# EAGLE design disinfection device control system (EAGLE 7.2.0)
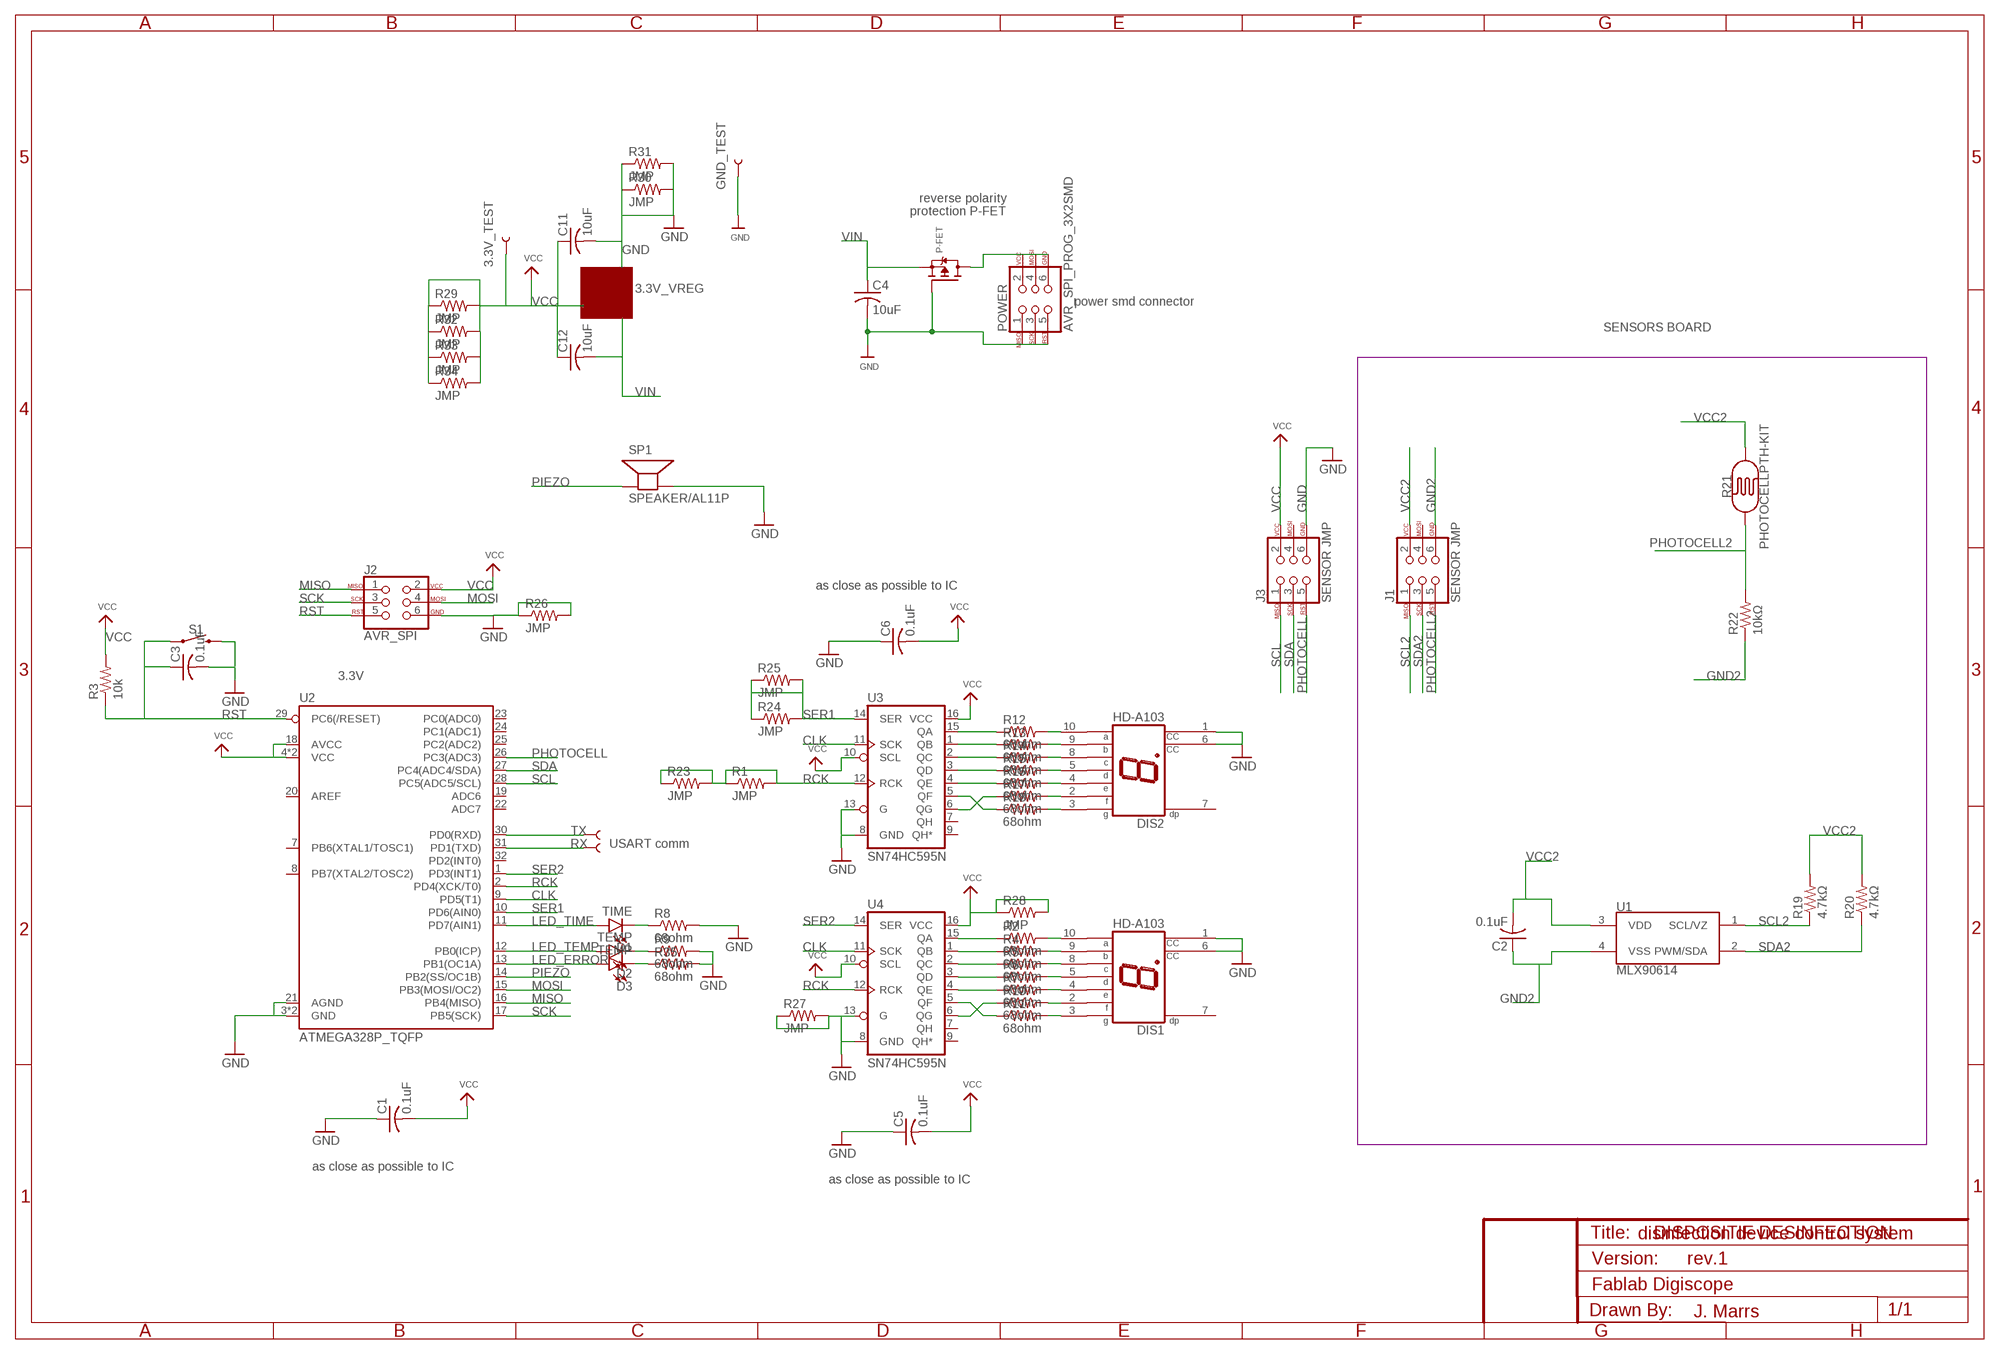
[diagram p0: schematic, sheet 1]

## Parts
3.3V_TEST  TEST-POINT3  [PAD.03X.03]
3.3V_VREG  MOSFET_PCH-DMG2305UX-7  [SOT23-3]
C1  0.1uF  C-USC1206  [C1206]
C2  0.1uF  C-USC1206  [C1206]
C3  0.1uF  C-USC1206  [C1206]
C4  10uF  C-USC1206  [C1206]
C5  0.1uF  C-USC1206  [C1206]
C6  0.1uF  C-USC1206  [C1206]
C11  10uF  C-USC1206  [C1206]
C12  10uF  C-USC1206  [C1206]
D1  TIME  LED-RED1206  [LED-1206]
D2  TEMP  LED-RED1206  [LED-1206]
D3  TEMP  LED-RED1206  [LED-1206]
DIS1  HD-A103  [HDSP-A]
DIS2  HD-A103  [HDSP-A]
GND_TEST  TEST-POINT3  [PAD.03X.03]
J1  SENSOR JMP  AVR_SPI_PROG_3X2SMD  [2X3_SMT_POSTS]
J2  AVR_SPI  AVR_SPI_PROG_3X2SMD  [2X3_SMT_POSTS]
J3  SENSOR JMP  AVR_SPI_PROG_3X2SMD  [2X3_SMT_POSTS]
P-FET  MOSFET-PWIDE  [SOT23-WIDE]
POWER  AVR_SPI_PROG_3X2SMD  [2X3_SMT_POSTS]
R1  JMP  R-US_R1206  [R1206]
R2  68ohm  R-US_R1206  [R1206]
R3  10k  R-US_R1206  [R1206]
R4  68ohm  R-US_R1206  [R1206]
R5  68ohm  R-US_R1206  [R1206]
R6  68ohm  R-US_R1206  [R1206]
R7  68ohm  R-US_R1206  [R1206]
R8  68ohm  R-US_R1206  [R1206]
R9  68ohm  R-US_R1206  [R1206]
R10  68ohm  R-US_R1206  [R1206]
R11  68ohm  R-US_R1206  [R1206]
R12  68ohm  R-US_R1206  [R1206]
R13  68ohm  R-US_R1206  [R1206]
R14  68ohm  R-US_R1206  [R1206]
R15  68ohm  R-US_R1206  [R1206]
R16  68ohm  R-US_R1206  [R1206]
R17  68ohm  R-US_R1206  [R1206]
R18  68ohm  R-US_R1206  [R1206]
R19  4.7kΩ  R-US_R1206  [R1206]
R20  4.7kΩ  R-US_R1206  [R1206]
R21  PHOTOCELLPTH-KIT  [PHOTOCELL-KIT]
R22  10kΩ  R-US_R1206  [R1206]
R23  JMP  R-US_R1206  [R1206]
R24  JMP  R-US_R1206  [R1206]
R25  JMP  R-US_R1206  [R1206]
R26  JMP  R-US_R1206  [R1206]
R27  JMP  R-US_R1206  [R1206]
R28  JMP  R-US_R1206  [R1206]
R29  JMP  R-US_R1206  [R1206]
R30  JMP  R-US_R1206  [R1206]
R31  JMP  R-US_R1206  [R1206]
R32  JMP  R-US_R1206  [R1206]
R33  JMP  R-US_R1206  [R1206]
R34  JMP  R-US_R1206  [R1206]
R35  68ohm  R-US_R1206  [R1206]
RX  TEST-POINT3  [PAD.03X.03]
S1  MOMENTARY-SWITCH-SPST-PTH-6.0MM  [TACTILE_SWITCH_PTH_6.0MM]
SP1  SPEAKER/AL11P  [AL11P]
TX  TEST-POINT3  [PAD.03X.03]
U1  MLX90614  [TO-39]
U2  ATMEGA328P_TQFP  [TQFP32-08]
U3  SN74HC595N  74HC595N  [DIP16]
U4  SN74HC595N  74HC595N  [DIP16]

## Nets
CLK: U2.9(PD5(T1)) U3.11(SCK) U4.11(SCK)
GND: 3.3V_VREG.3(D) C1.1 C3.2 C4.2 C5.1 C6.1 C11.2 DIS1.1(CC) DIS1.6(CC) DIS2.1(CC) DIS2.6(CC) GND_TEST.P$1 J2.6 J3.6 P-FET.1(G) POWER.1 POWER.3 POWER.5 R8.2 R9.2 R26.1 R26.2 R27.1 R27.2 R30.1 R30.2 R31.1 R31.2 R35.2 S1.3 SP1.- U2.3(GND) U2.5(GND) U2.21(AGND) U3.8(GND) U3.13(G) U4.8(GND) U4.13(G)
GND2: C2.1 J1.6 R22.1 U1.4(VSS)
LED_ERROR: D3.A U2.13(PB1(OC1A))
LED_TEMP: D2.A U2.12(PB0(ICP))
LED_TIME: D1.A U2.11(PD7(AIN1))
MISO: J2.1 U2.16(PB4(MISO))
MOSI: J2.4 U2.15(PB3(MOSI/OC2))
N$1: DIS1.10(A) R2.2
N$2: DIS1.9(B) R4.2
N$4: DIS1.8(C) R5.2
N$5: DIS1.5(D) R6.2
N$6: TX.P$1 U2.30(PD0(RXD))
N$7: RX.P$1 U2.31(PD1(TXD))
N$8: DIS1.4(E) R7.2
N$9: R2.1 U4.15(QA)
N$10: R4.1 U4.1(QB)
N$11: D2.C R9.1
N$12: DIS1.2(F) R10.2
N$13: DIS1.3(G) R11.2
N$14: R5.1 U4.2(QC)
N$15: R6.1 U4.3(QD)
N$16: R7.1 U4.4(QE)
N$17: R10.1 U4.6(QG)
N$18: R11.1 U4.5(QF)
N$19: R17.1 U3.6(QG)
N$20: R18.1 U3.5(QF)
N$21: DIS2.10(A) R12.2
N$22: DIS2.9(B) R13.2
N$23: DIS2.8(C) R14.2
N$24: DIS2.5(D) R15.2
N$25: DIS2.4(E) R16.2
N$26: DIS2.2(F) R17.2
N$27: DIS2.3(G) R18.2
N$28: R12.1 U3.15(QA)
N$29: R13.1 U3.1(QB)
N$30: R14.1 U3.2(QC)
N$31: R15.1 U3.3(QD)
N$32: R16.1 U3.4(QE)
N$36: D3.C R35.1
PHOTOCELL: J3.5 U2.26(PC3(ADC3))
PHOTOCELL2: J1.5 R21.1 R22.2
PIEZO: SP1.+ U2.14(PB2(SS/OC1B))
PWRIN: P-FET.3(D) POWER.2 POWER.4 POWER.6
RCK: R1.1 R1.2 R23.1 R23.2 U2.2(PD4(XCK/T0)) U3.12(RCK) U4.12(RCK)
RST: C3.1 J2.5 R3.1 S1.1 U2.29(PC6(/RESET))
SCK: J2.3 U2.17(PB5(SCK))
SCL: J3.1 U2.28(PC5(ADC5/SCL))
SCL2: J1.1 R19.1 U1.1(SCL/VZ)
SDA: J3.3 U2.27(PC4(ADC4/SDA))
SDA2: J1.3 R20.1 U1.2(PWM/SDA)
SER1: R24.1 R24.2 R25.1 R25.2 U2.10(PD6(AIN0)) U3.14(SER)
SER2: U2.1(PD3(INT1)) U4.14(SER)
TIME: D1.C R8.1
VCC: 3.3V_TEST.P$1 3.3V_VREG.1(G) C1.2 C5.2 C6.2 C11.1 C12.1 J2.2 J3.2 R3.2 R28.1 R28.2 R29.1 R29.2 R32.1 R32.2 R33.1 R33.2 R34.1 R34.2 U2.4(VCC) U2.6(VCC) U2.18(AVCC) U3.10(SCL) U3.16(VCC) U4.10(SCL) U4.16(VCC)
VCC2: C2.2 J1.2 R19.2 R20.2 R21.2 U1.3(VDD)
VIN: 3.3V_VREG.2(S) C4.1 C12.2 P-FET.2(S)
Unconnected: DIS1.7(DP) DIS2.7(DP) J1.4 J3.4 U2.7(PB6(XTAL1/TOSC1)) U2.8(PB7(XTAL2/TOSC2)) U2.19(ADC6) U2.20(AREF) U2.22(ADC7) U2.23(PC0(ADC0)) U2.24(PC1(ADC1)) U2.25(PC2(ADC2)) U2.32(PD2(INT0)) U3.7(QH) U3.9(QH*) U4.7(QH) U4.9(QH*)

## Notes on the sheet
- reverse polarity
- protection P-FET
- power smd connector
- SENSORS BOARD
- as close as possible to IC
- 3.3V
- USART comm
- as close as possible to IC
- as close as possible to IC
- DISPOSITIF DESINFECTION
- rev.1
- Fablab Digiscope
- J. Marrs

## Library data of the parts
3.3V_TEST GND_TEST RX TX = SparkFun-Connectors:TEST-POINT: SparkFun Test Points Bare copper test points for troubleshooting or In-Circuit-Testing. These are used by our Production team for verifying production board runs using pogo-pins on test beds. SparkFun Products: SparkFun LSM9DS1 Breakout <https://www.sparkfun.com/products/13284> SparkFun PSOC <https://www.sparkfun.com/products/13714> SparkFun Load Cell Amplifier <https://www.sparkfun.com/products/13879>
3.3V_VREG = SparkFun-DiscreteSemi:MOSFET_PCH: P-channel MOSFETs Voltage controlled devices that allow control of high current outputs. SparkFun Products: SparkFun ESP32 Thing <https://www.sparkfun.com/products/13907> SparkFun ESP8266 Thing <https://www.sparkfun.com/products/13231> SparkFun Pi Servo HAT V2 <https://www.sparkfun.com/products/15316> DMG2305UX-7 (20V/4.2A/SOT23-3); PROD_ID: TRAN-14388; VALUE: 20V/4.2A/52mΩ/1.4W
C1-C6 C11 C12 = adafruit:C-US: CAPACITOR, American symbol
D1-D3 = SparkFun-LED:LED-RED: Red SMD LED Used in manufacturing of most products at SparkFun Packages: 0603 - SMD 0603 package [Product Link] <http://docs.avagotech.com/docs/AV02-0551EN> 0603 SMART - SMD 0603 SMART package ( more efficient and expensive)[Product Link] <http://www.osram-os.com/Graphics/XPic2/00077099_0.pdf> 1206 - SMD1206 package [Product Link] <https://www.sparkfun.com/datasheets/DevTools/LilyPad/Q150OVS4.pdff> SparkFun Products: Pro Mini 328 -5V <https://www.sparkfun.com/products/821> RedBoard <https://www.sparkfun.com/products/12757> IOIO-OTG <https://www.sparkfun.com/products/13613>; PROD_ID: DIO-09912; VALUE: RED
DIS1 DIS2 = display-hp:HD-A103: LED DISPLAY 1-character 7 segment, decimal point right; OC_FARNELL: unknown; OC_NEWARK: unknown
J1-J3 POWER = SparkFun-Connectors:AVR_SPI_PROG_3X2: AVR ISP 6 Pin This is the reduced ISP connector for AVR programming. Common on Arduino. This footprint will take up less PCB space and can be used with a 10-pin to 6-pin adapter such as SKU: BOB-08508 **Special note about "TEST_POINT" package. The stop mask is on the top side, so if you want your programming test points to be on the bottom of your board, make sure to place this package on the bottom side of the board. This also ensure that the orientation to program from the bottom side will be correct. SparkFun Products: SparkFun ISP Pogo Adapter <https://www.sparkfun.com/products/11591> - NS Tiny AVR Programmer <https://www.sparkfun.com/products/11801> -PTH
P-FET = microbuilder:MOSFET-P: P-Channel Mosfet LEGEND VDS: Voltage Drain-Source ID: Drain Current RDS(ON): Drain-Source On-State Resistance VGS(TH): Gate-Source Threshold Voltage CISS: Drain-Source Input Capacitance SOT-23 Name VDS ID RDS(ON) VGS(TH) CISS Order Number IRLML5103 30V 760mA 600 mOhm -- 75pF @ 25V Digikey: IRLML5103PBFCT-ND IRLML6401 12V 4.3A 50 mOhm 950mV @ 250µA 830pF @ 10V Digikey: IRLML6401PBFTR-ND NTR0202PL 20V 400mA 800 mOhm 2.3V @ 250uA 70pF @ 5V Digikey: NTR0202PLT1GOSTR-ND NTR4101PT1G 20V 1.8A 85 mOhm 1.2V @ 250uA 675pF @ 10V Digikey: NTR4101PT1GOSCT-ND DMP2004K 20V 600mA 900 mOhm 1V @ 250uA 175pF @ 16V Digikey: DMP2004KDICT-ND PMV65XP 20V 3.9A 76 mOhm 950mV @ 1mA 725pF @ 20V Digikey: 568-2358-2-ND TO-252 Name VDS ID RDS(ON) VGS(TH) CISS Order Number AOD417 30V 25A 34 mOhm 3V @ 250µA 920pF @ 15V Digikey: 785-1106-2-ND
R1-R20 R22-R35 = adafruit:R-US_: RESISTOR, American symbol
R21 = SparkFun-Sensors:PHOTOCELL: Photocell (Photodetector, Photo Resistor, CdS) This is a very small light sensor. A photocell changes (also called a photodetector, photo resistor, CdS or photoconductive cell) resistance depending on the amount of light it is exposed to. These little sensors make great ambient light triggers (when light in the room turns on, do something). Datasheet <http://cdn.sparkfun.com/datasheets/Sensors/LightImaging/SEN-09088.pdf> SparkFun Products Mini Photocell <https://www.sparkfun.com/products/9088> (SEN-09088); PROD_ID: COMP-09129; SF_ID: SEN-09088
S1 = SparkFun-Switches:MOMENTARY-SWITCH-SPST: Momentary Switch (Pushbutton) - SPST Normally-open (NO) SPST momentary switches (buttons, pushbuttons). Variants PTH-12MM - 12mm square, through-hole Momentary Pushbutton Switch - 12mm Square <https://www.sparkfun.com/products/9190> (COM-09190) PTH-6.0MM, PTH-6.0MM-KIT - 6.0mm square, through-hole Mini Pushbutton Switch <https://www.sparkfun.com/products/97> (COM-00097) KIT package intended for soldering kit's - only one side of pads' copper is exposed. PTH-RIGHT-ANGLE-KIT - Right-angle, through-hole Right Angle Tactile Button <https://www.sparkfun.com/products/10791> - Used on SparkFun BigTime Watch Kit <https://www.sparkfun.com/products/11734> SMD-12MM - 12mm square, surface-mount Tactile Button - SMD (12mm) <https://www.sparkfun.com/products/12993> (COM-12993) Used on SparkFun PicoBoard <https://www.sparkfun.com/products/11888> SMD-4.5MM - 4.5mm Square Trackball Switch Used on SparkFun Blackberry Trackballer Breakout <https://www.sparkfun.com/products/13169> SMD-4.6MMX2.8MM - 4.60mm x 2.80mm, surface mount Used on SparkFun SAMD21 Mini Breakout <https://www.sparkfun.com/products/13664> SMD-5.2MM, SMD-5.2-REDUNDANT - 5.2mm square, surface-mount Mini Pushbutton Switch - SMD <https://www.sparkfun.com/products/8720> (COM-08720) Used on Arduino Pro Mini <https://www.sparkfun.com/products/11114> REDUNDANT package connects both switch circuits together SMD-6.0X3.5MM - 6.0 x 3.5mm, surface mount Momentary Reset Switch SMD <https://www.sparkfun.com/products/8229> (COM-08229) SMD-6.2MM-TALL - 6.2mm square, surface mount Tactile Button - SMD (6mm) <https://www.sparkfun.com/products/12992> Used on SparkFun Digital Sandbox <https://www.sparkfun.com/products/12651> SMD-RIGHT-ANGLE - Right-angle, surface mount Used on SparkFun Block for Intel® Edison - Arduino <https://www.sparkfun.com/products/13036>; PROD_ID: SWCH-08441; SF_SKU: COM-00097
SP1 = adafruit:SPEAKER: SPEAKER Source: Buerklin Added PS12 (for part # PS1240 piezo) http://www.ladyada.net/library/pcb/eaglelibrary.html
U1 = SparkFun-Sensors:MLX90614: Melexis MLX90614 Infrared (IR) Thermometer The MLX90614 is a passive infrared (PIR) I2C temperature sensor.It is designed for non-contact temperature sensing. An internal 17-bit ADC and a powerful DSP contribute to the MLX90614’s high accuracy and resolution. It has a huge number of applications including body temperature measurment and movement detection. Datasheet <http://www.sparkfun.com/datasheets/Sensors/Temperature/SEN-09570-datasheet-3901090614M005.pdf> SparkFun Products Infrared Thermometer - MLX90614 <https://www.sparkfun.com/products/9570> (SEN-09570) SparkFun IR Thermometer Evaluation Board - MLX90614 <https://www.sparkfun.com/products/10740> (SEN-10740); PROD_ID: COMP-09719; SF_ID: SEN-09570
U2 = SparkFun-IC-Microcontroller:ATMEGA328P_TQFP: Popular 328P in QFP Storefront component: ATmega328 - TQFP <https://www.sparkfun.com/products/13448> (COM-13448) Datasheet <http://www.sparkfun.com/datasheets/Components/SMD/ATMega328.pdf> SparkFun Products SparkFun RedBoard - Programmed with Arduino <https://www.sparkfun.com/products/12757> (DEV-12757) Arduino Pro Mini 328 - 5V/16MHz <https://www.sparkfun.com/products/11113> (DEV-11113) Arduino Pro Mini 328 - 3.3V/8MHz <https://www.sparkfun.com/products/11114> (DEV-11114) SparkFun OpenLog <https://www.sparkfun.com/products/13712> (DEV-13712) SparkFun MicroView - OLED Arduino Module <https://www.sparkfun.com/products/12923> (DEV-12923) SparkFun Digital Sandbox <https://www.sparkfun.com/products/12651> (DEV-12651) SparkFun PicoBoard <https://www.sparkfun.com/products/11888> (WIG-11888) Arduino Fio <https://www.sparkfun.com/products/10116> (DEV-10116) LilyPad Arduino 328 Main Board <https://www.sparkfun.com/products/13342> (DEV-13342) SparkFun RedStick <https://www.sparkfun.com/products/13741> (DEV-13741) LilyPad MP3 <https://www.sparkfun.com/products/11013> (DEV-11013) LilyPad Arduino SimpleSnap <https://www.sparkfun.com/products/10941> (DEV-10941) SparkFun Stepoko <https://www.sparkfun.com/products/13899> (ROB-13899) SparkFun Geiger Counter <https://www.sparkfun.com/products/11345> (SEN-11345) SparkFun EL Sequencer <https://www.sparkfun.com/products/12781> (COM-12781) Arduino Pro 328 - 5V/16MHz <https://www.sparkfun.com/products/10915> (DEV-10915) CryptoCape <https://www.sparkfun.com/products/12773> (DEV-12773) SparkFun IR Thermometer Evaluation Board - MLX90614 <https://www.sparkfun.com/products/10740> (SEN-10740) SparkFun RedBot Mainboard <https://www.sparkfun.com/products/12097> (ROB-12097) Arduino Pro 328 - 3.3V/8MHz <https://www.sparkfun.com/products/10914> (DEV-10914) SparkFun Block for Intel® Edison - Arduino <https://www.sparkfun.com/products/13036> (DEV-13036) SparkFun Simon Says - Surface Mount Soldering Kit <https://www.sparkfun.com/products/10935> (KIT-10935) SparkFun 7-Segment Serial Display - Red <https://www.sparkfun.com/products/11441> (COM-11441) SparkFun 7-Segment Serial Display - White <https://www.sparkfun.com/products/11629> (COM-11629) SparkFun 7-Segment Serial Display - Yellow <https://www.sparkfun.com/products/11443> (COM-11443) SparkFun 7-Segment Serial Display - Kelly Green <https://www.sparkfun.com/products/11440> (COM-11440) SparkFun 7-Segment Serial Display - Blue <https://www.sparkfun.com/products/11442> (COM-11442) SparkFun OpenSegment Serial Display - 20mm (Blue) <https://www.sparkfun.com/products/11647> (COM-11647) SparkFun OpenSegment Serial Display - 20mm (Green) <https://www.sparkfun.com/products/11646> (COM-11646) SparkFun OpenSegment Serial Display - 20mm (White) <https://www.sparkfun.com/products/11648> (COM-11648) SparkFun OpenSegment Serial Display - 20mm (Red) <https://www.sparkfun.com/products/11644> (COM-11644) SparkFun OpenSegment Serial Display - 20mm (Yellow) <https://www.sparkfun.com/products/11645> (COM-11645) SparkFun OpenSegment Shield <https://www.sparkfun.com/products/13190> (DEV-13190); PROD_ID: IC-09069
U3 U4 = SparkFun-IC-Logic:74*595: 8-Bit Shift Register (Serial to Parallel) Datasheet <http://cdn.sparkfun.com/datasheets/BreakoutBoards/MM74HC595.pdf> SparkFun Products SparkFun Shift Register Breakout - 74HC595 <https://www.sparkfun.com/products/10680> (BOB-10680); PROD_ID: IC-13123

## Board
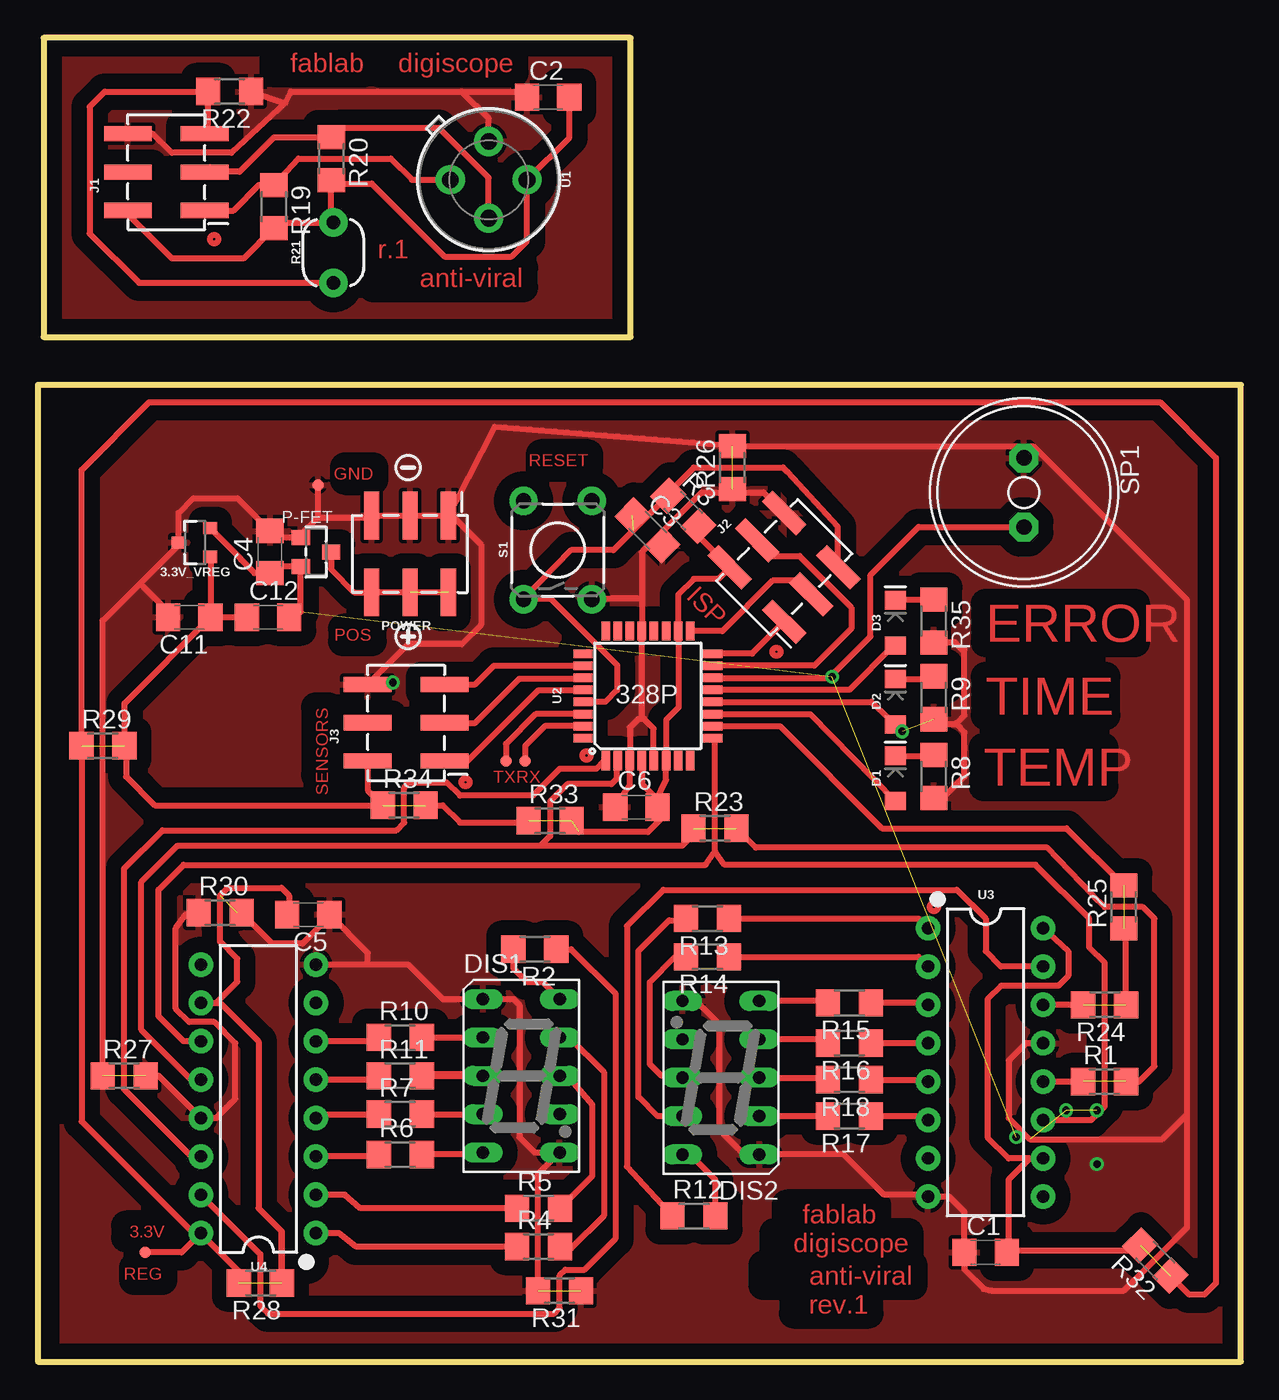
[diagram p1: board, top side]

Size 79.63 x 87.63 mm. Coordinates in mm from the lower left corner, seen from the top.
Outline: 0.38,87.63 0.38,67.82 39.24,67.82 39.24,87.63 0.38,87.63
Outline: 0,0 79.63,0 79.63,64.64 0,64.64 0,0
Copper layers (1*16): Top 0.035mm / dielectric 1.5mm / Bottom 0.035mm
Design rules "adafruit *": minimum track width 1mm, minimum drill 1mm, track to track 1mm, track to pad 1mm, pad to pad 1mm, via to via 1mm, smd to smd 1mm, copper to edge 1mm, drill to drill 1mm, minimum pad ring 10mil, minimum via ring 8mil, stop-mask expansion 2mil, vias tented up to drill 20mil, thermal gap 10mil

### Footprints (pad centres in the part's own frame; a part is rotated, then mirrored left to right if it is on the bottom)
PAD.03X.03 = smd 0.762 x 0.762: P$1 0,0
SOT23-3 = smd 0.8 x 0.9: 1 -0.95,-1; 2 0.95,-1; 3 0,1.1
C1206 = smd 1.6 x 1.8: 1 -1.4,0; 2 1.4,0
LED-1206 = smd 1.2 x 1.4: A -1.5,0; C 1.5,0
HDSP-A = drill 0.813 long: 1 -2.54,5.08; 2 -2.54,2.54; 3 -2.54,0; 4 -2.54,-2.54; 5 -2.54,-5.08; 6 2.54,-5.08; 7 2.54,-2.54; 8 2.54,0; 9 2.54,2.54; 10 2.54,5.08
2X3_SMT_POSTS = smd 1 x 3.17: 1 -2.54,-2.54; 2 -2.54,2.54; 3 0,-2.54; 4 0,2.54; 5 2.54,-2.54; 6 2.54,2.54
SOT23-WIDE = smd 1 x 1.2: 1 -0.95,-1; 2 0.95,-1; 3 0,1
R1206 = smd 1.6 x 1.803: 1 -1.422,0; 2 1.422,0
PHOTOCELL-KIT = drill 0.9 pad 1.88: 1 -2,0; 2 2,0
TACTILE_SWITCH_PTH_6.0MM = drill 1.016 pad 1.88: 1 -3.251,2.261; 2 3.251,2.261; 3 -3.251,-2.261; 4 3.251,-2.261
AL11P = drill 1.016 pad 1.905 octagon: + 2.286,0; - -2.286,0
TO-39 = drill 1.1 pad 1.93: 1 2.54,0; 2 0,2.54; 3 -2.54,0; 4 0,-2.54
TQFP32-08 = smd 1.27 x 0.559: 1 -4.293,2.8; 2 -4.293,2; 3 -4.293,1.2; 4 -4.293,0.4; 5 -4.293,-0.4; 6 -4.293,-1.2; 7 -4.293,-2; 8 -4.293,-2.8; 17 4.293,-2.8; 18 4.293,-2; 19 4.293,-1.2; 20 4.293,-0.4; 21 4.293,0.4; 22 4.293,1.2; 23 4.293,2; 24 4.293,2.8 | smd 0.559 x 1.27: 9 -2.8,-4.293; 10 -2,-4.293; 11 -1.2,-4.293; 12 -0.4,-4.293; 13 0.4,-4.293; 14 1.2,-4.293; 15 2,-4.293; 16 2.8,-4.293; 25 2.8,4.293; 26 2,4.293; 27 1.2,4.293; 28 0.4,4.293; 29 -0.4,4.293; 30 -1.2,4.293; 31 -2,4.293; 32 -2.8,4.293
DIP16 = drill 0.813 pad 1.626: 1 -8.89,-3.81; 2 -6.35,-3.81; 3 -3.81,-3.81; 4 -1.27,-3.81; 5 1.27,-3.81; 6 3.81,-3.81; 7 6.35,-3.81; 8 8.89,-3.81; 9 8.89,3.81; 10 6.35,3.81; 11 3.81,3.81; 12 1.27,3.81; 13 -1.27,3.81; 14 -3.81,3.81; 15 -6.35,3.81; 16 -8.89,3.81

### Placement (x,y rotation side)
3.3V_TEST  7.11,7.24 180 top
3.3V_VREG  10.41,54.23 90 top
C1  62.74,7.24 0 top
C2  33.78,83.69 0 top
C3  40.36,55.02 315 top
C4  15.37,53.59 90 top
C5  17.91,29.59 180 top
C6  39.62,36.7 0 top
C11  10.03,49.28 180 top
C12  15.24,49.28 0 top
D1  56.77,38.61 90 top
D2  56.77,43.69 90 top
D3  56.77,48.89 90 top
DIS1  32,18.92 0 top
DIS2  45.21,18.8 180 top
GND_TEST  18.54,58.04 180 top
J1  8.51,78.74 90 top
J2  49.4,52.58 45 top
J3  24.38,42.29 90 top
P-FET  18.41,53.59 270 top
POWER  24.64,53.47 180 top
R1  70.61,18.54 0 top
R2  32.89,27.3 180 top
R3  42.72,56.31 315 top
R4  33.15,7.62 0 top
R5  33.15,10.16 0 top
R6  24,13.72 0 top
R7  24,16.38 0 top
R8  59.31,38.73 270 top
R9  59.31,43.94 270 top
R10  24,21.46 0 top
R11  24,18.92 0 top
R12  43.43,9.65 0 top
R13  44.32,29.34 180 top
R14  44.32,26.8 180 top
R15  53.72,23.75 180 top
R16  53.72,21.08 180 top
R17  53.72,16.26 180 top
R18  53.72,18.67 180 top
R19  15.62,76.45 270 top
R20  19.43,79.63 270 top
R21  19.56,73.41 90 top
R22  12.7,84.07 180 top
R23  44.83,35.31 0 top
R24  70.61,23.62 180 top
R25  71.88,30.1 90 top
R26  45.97,59.18 90 top
R27  5.71,18.92 0 top
R28  14.73,5.21 180 top
R29  4.32,40.77 0 top
R30  12.06,29.72 0 top
R31  34.54,4.7 180 top
R32  73.97,6.7 135 top
R33  33.91,35.81 0 top
R34  24.26,36.83 0 top
R35  59.31,49.02 270 top
RX  32.26,39.75 0 top
S1  34.42,53.72 90 top
SP1  65.28,57.53 270 top
TX  30.99,39.75 0 top
U1  29.84,78.23 180 top
U2  40.39,44.07 90 top
U3  62.74,19.81 270 top
U4  14.6,17.4 90 top
U$15  [SYMBOL_PLUS]  24.51,48.01 180 top
U$16  [SYMBOL_MINUS]  24.51,59.18 180 top

### Tracks (layer width: path | path; a pad name or v marks a point on that pad's centre or on a via)
CLK
  Top 0.406: U4.11 9.65,21.21 8,22.86 8,31.24 9.65,32.89 44.2,32.89 44.83,33.78 | 44.83,33.78 44.83,41.12 U2.9 | U3.11 69.72,16 70.61,16.89 70.61,26.42 69.6,27.43 69.6,29.34 66.04,32.89 45.47,32.89 44.83,33.78
GND  (via drill 0.5)  (6 unrouted)
  Top 0.406: U4.8 21.84,26.29 | 21.84,26.29 24.51,26.29 26.8,24 DIS1.1 31.5,24 31.88,23.62 31.88,14.86 32.89,13.84 DIS1.6 33.12,12.42 R31.2 | C1.1 | U2.5 40.77,39.79 40.77,41.91 40.13,42.54 | 40.13,42.54 39.75,42.54 39.19,41.98 U2.3 39.19,38.17 C6.1 | 40.13,42.54 39.99,42.69 U2.21 39.99,50.55 | J2.6 48.04,57.53 43.94,57.53 39.99,53.57 39.99,50.55 | POWER.3 POWER.5 21.97,55.88 18.54,55.88 | POWER.3 POWER.1 30.25,61.87 R26.2 65.53,60.6 | S1.3 38,50.55 39.99,50.55 | DIS2.6 43.56,23.88 45.09,22.35 45.09,15.37 46.74,13.72 DIS2.1 53.34,13.72 56.01,11.05 58.8,11.05 U3.8 60.33,10.92 61.34,9.91 C1.1 | R8.2 60.17,37.57 61.34,38.73 61.34,41.66 60.83,42.16 | 60.83,42.16 59.66,42.16 R9.2 | 60.83,42.16 60.83,42.29 61.34,42.8 61.34,47.12 61.21,47.12 60.71,47.62 59.33,47.62 R35.2 | 65.53,60.6 65.89,60.6 76.07,50.42 76.07,16.38 | C1.1 61.34,6.1 62.61,4.83 63.12,4.7 71.88,4.7 76.07,8.89 76.07,16.38 | R27.1 4.29,49.02 | 4.29,49.02 4.29,49.08 | POWER.3 27.43,56.01 29.34,54.1 29.34,48.77 28.07,47.5 24.51,47.5 J3.6 | 6.78,51.51 9.31,54.04 3.3V_VREG.3 9.31,56.18 10.29,57.15 13.21,57.15 C4.2 15.82,54.54 P-FET.1 17.41,54.75 18.54,55.88 | 6.78,51.51 4.29,49.02 | C11.2 8.63,49.66 6.78,51.51 | 18.54,55.88 GND_TEST.P$1 | R27.2 8,18.92 U4.13 11.81,16.13 13.08,17.4 13.08,21.08 11.68,22.48 10.03,22.48 9.14,23.37 9.14,28.7 9.78,29.59 10.52,29.59 R30.1 | 65.28,60.07 SP1.- 65.28,59.31 65.53,59.56 65.53,60.6 | U3.13 65.41,21.08 64.26,19.94 64.26,16.13 65.66,14.73 74.42,14.73 76.07,16.38 | 21.84,26.29 21.84,27.05 C5.1 19.31,29.47 17.53,27.69 15.52,27.69 R30.2
  other vias: 57.21,41.72 68.07,16.64 70.1,13.08 23.49,44.96 70.1,16.64
  pour Top: 1.65,64.77 78.87,64.52 78.87,1.02 1.65,1.27
GND2
  Top 0.406: J1.6 7.62,81.28 8.89,80.01 12.82,80.01 16.38,83.31 | 22.48,84.08 22.48,84.07 | 16.38,83.31 16.76,84.07 22.48,84.07 | 22.48,84.07 28.07,84.07 | 28.07,84.07 32.97,84.07 C2.1 | U1.4 29.84,82.3 28.07,84.07 | R22.1 16.38,83.31
  pour Top: 1.14,86.74 1.02,68.71 38.23,68.71 38.35,86.74
LED_ERROR
  Top 0.406: U2.13 53.72,44.47 56.64,47.39 D3.A
LED_TEMP
  Top 0.406: U2.12 55.16,43.67 D2.A
LED_TIME
  Top 0.406: U2.11 51.14,42.87 D1.A
MISO
  Top 0.406: J2.1 47.29,46.87 U2.16
MOSI
  Top 0.406: J2.4 48.64,53.34 50.42,53.34 53.85,49.91 53.85,48.51 51.4,46.07 U2.15
N$1
  Top 0.406: R2.2 31.47,26.06 32.39,25.15 33.4,25.15 DIS1.10
N$2
  Top 0.406: DIS1.9 35.18,21.46 37.47,19.18 37.47,9.65 35.31,7.49 34.57,7.49 R4.2
N$4
  Top 0.406: R5.2 36.7,12.29 36.7,17.02 35.05,18.92 DIS1.8
N$5
  Top 0.406: DIS1.5 29.34,13.72 R6.2
N$6
  Top 0.406: U2.30 32.96,42.87 30.99,40.89 TX.P$1
N$7
  Top 0.406: U2.31 33.56,42.07 32.26,40.77 RX.P$1
N$8
  Top 0.406: R7.2 DIS1.4
N$9
  Top 0.406: R2.1 35.31,27.3 38.23,24.38 38.23,8.13 36.2,6.1 34.93,6.1 34.54,5.71 34.54,3.56 34.16,3.17 15.24,3.17 14.73,3.68 14.73,7.11 U4.15
N$10
  Top 0.406: R4.1 21.08,7.62 19.94,8.51 U4.1
N$11
  Top 0.406: D2.C 59.13,45.19 R9.1
N$12
  Top 0.406: R10.2 DIS1.2
N$13
  Top 0.406: R11.2 DIS1.3
N$14
  Top 0.406: R5.1 21.34,10.16 20.32,11.05 U4.2
N$15
  Top 0.406: R6.1 22.84,13.59 U4.3
N$16
  Top 0.406: U4.4 18.67,16.38 R7.1
N$17
  Top 0.406: R10.1 22.84,21.21 U4.6
N$18
  Top 0.406: R11.1 22.71,18.67 U4.5
N$19
  Top 0.406: U3.6 58.67,16.26 R17.1
N$20
  Top 0.406: 58.67,18.8 U3.5 58.93,18.67 R18.1
N$21
  Top 0.406: DIS2.10 42.42,13.46 43.43,13.46 44.83,12.07 44.83,9.68 R12.2
N$22
  Top 0.406: DIS2.9 41.02,16.26 39.75,17.53 39.75,27.18 41.78,29.21 42.77,29.21 R13.2
N$23
  Top 0.406: DIS2.8 42.55,18.92 41.28,18.92 40.51,19.68 40.51,25.14 42.15,26.78 R14.2
N$24
  Top 0.406: R15.2 51.79,23.88 DIS2.5
N$25
  Top 0.406: R16.2 51.79,21.34 DIS2.4
N$26
  Top 0.406: R17.2 DIS2.2
N$27
  Top 0.406: DIS2.3 52.3,18.8 R18.2
N$28
  Top 0.406: U3.15 63.75,26.16 62.74,27.18 62.74,29.34 60.83,31.24 41.4,31.24 38.99,28.83 38.99,12.93 R12.1
N$29
  Top 0.406: 58.67,28.96 U3.1 58.29,29.34 R13.1
N$30
  Top 0.406: R14.1 58.29,26.8 U3.2
N$31
  Top 0.406: U3.3 58.8,23.75 R15.1
N$32
  Top 0.406: U3.4 R16.1
N$33
  Top 0.406: 29.59,19.05 25.78,19.05 25.78,18.8
N$34
  Top 0.406: 42.42,26.92 43.05,26.8
N$36
  Top 0.406: D3.C 56.69,50.44 R35.1
PHOTOCELL
  Top 0.406: J3.5 28.96,44.83 30.19,46.07 U2.26
PHOTOCELL2
  Top 0.406: J1.5 10.67,81.28 11.28,81.89 R22.2 4.45,84.07 3.43,83.06 3.43,74.68 6.7,71.41 R21.1
PIEZO
  Top 0.406: U2.14 52.38,45.27 55.12,48.01 55.12,52.07 58.29,55.24 SP1.+
PWRIN  (1 unrouted)
  Top 0.406: POWER.2 POWER.6 | 22.08,50.93 POWER.6 | P-FET.3 19.41,52.47 20.95,50.93 POWER.6
RCK  (2 unrouted)
  Top 0.406: U3.12 R1.1 | U4.12 10.16,18.67 6.86,21.97 6.86,31.75 9.27,34.16 33.27,34.16 | 33.27,34.16 42.67,34.16 43.41,34.9 R23.1 | U2.2 38.35,39.74 38.35,38.61 37.97,38.23 35.05,38.23 33.91,37.08 33.91,34.8 33.27,34.16 | R1.2 72.9,18.54 73.91,19.56 73.91,29.34 73.15,30.1 70.61,30.1 69.85,30.86 66.8,34.04 47.52,34.04 R23.2
RST  (1 unrouted)
  Top 0.406: J2.5 52.96,52.61 52.96,55.24 49.63,58.89 49.33,59.18 43.43,59.18 41.47,57.21 R3.1 40.6,56.2 39.43,55.05 38.1,53.72 35.28,53.72 S1.1 33.98,50.47 38.35,46.1 38.35,44.45 37.57,43.67 U2.29
SCK
  Top 0.406: J2.3 50.29,51.69 48.64,51.69 45.31,48.36 U2.17
SCL
  Top 0.406: J3.1 28.45,39.75 33.15,44.45 36.07,44.45 U2.28
SCL2
  Top 0.406: J1.1 12.95,76.2 14.63,77.88 R19.1 17.25,79.63 23.37,79.63 24.77,78.23 U1.1
SDA
  Top 0.406: J3.3 28.96,42.29 31.88,45.21 36.04,45.21 U2.27
SDA2
  Top 0.406: J1.3 11.41,79.1 11.74,78.77 13.36,78.77 15.62,81.03 19.41,81.03 R20.1 20.04,81.66 26.54,81.66 29.84,78.36 U1.2
SER1  (2 unrouted)
  Top 0.406: R24.2 U3.14 | U2.10 49.12,42.07 55.88,35.31 68.1,35.31 R25.2 | R24.1 72.03,28.42 72.01,28.45 R25.1
SER2
  Top 0.406: 37.59,39.74 U2.1 | 37.62,39.52 U2.1 | U4.14 10.16,13.59 5.71,18.03 5.71,32.64 8.26,35.18 23.75,35.18 24.26,35.69 24.26,37.97 24.51,38.35 27.05,38.35 27.94,37.46 32.77,37.46 34.54,39.24 36.96,39.24 37.56,39.88 U2.1
TIME
  Top 0.406: D1.C 59.26,40.11 R8.1
VCC  (7 unrouted)
  Top 0.406: C1.2 64.26,7.36 | 64.26,7.36 64.26,12.07 65.66,13.46 | 65.66,13.46 U3.10 | J2.2 45.05,51.82 43.43,51.82 42.39,50.77 U2.18 42.42,48.33 42.42,43.31 41.59,42.47 U2.6 41.59,38.54 40.89,37.08 | U2.4 40.01,39.76 40.01,38.23 41.02,37.21 40.77,37.08 40.89,37.08 | 45.06,53.34 44.96,53.47 45.81,52.61 J2.2 | 40.89,37.08 41.02,36.32 C6.2 41.53,36.2 40.39,35.05 35.81,35.05 | 3.3V_TEST.P$1 9.53,7.24 10.54,8.26 | R3.2 43.73,54.66 J2.2 | C11.1 C12.1 | 10.54,8.26 U4.16 | 16.13,8.64 14.6,10.16 14.6,21.21 12.06,23.75 U4.10 11.81,23.75 13.21,25.15 13.21,26.67 12.06,27.81 12.06,30.86 12.57,31.37 16.13,31.37 16.64,30.86 16.64,29.72 C5.2 | 16.13,8.64 16.13,5.21 | U4.16 13.33,5.97 | C11.1 5.74,43.58 R29.2 5.84,40.66 5.84,38.73 7.75,36.83 R34.1 21.84,37.82 J3.2 | 10.54,8.26 2.9,15.9 R29.1 2.9,59.03 7.37,63.5 74.3,63.5 77.98,59.82 77.98,5.21 77.22,4.45 76.22,4.45 | 13.21,29.72 13.21,29.71 | 64.26,7.36 72.62,7.36 R32.2 | 76.22,4.45 R32.1 | R34.2 26.8,36.83 27.94,35.69 32.23,35.69 R33.1 | R28.2 13.31,5.99 U4.16 | R28.1 16.15,8.61 16.13,8.64 | 3.3V_VREG.1 11.43,53.26 C11.1 | 76.22,4.45 76.2,4.45 | 65.66,13.46 64.26,13.46 62.87,14.86 62.87,24 63.75,24.89 67.56,24.89 68.2,25.53 68.2,27.18 U3.16
VCC2
  Top 0.406: J1.2 5.97,75.95 8.89,73.02 13.61,73.02 R19.2 15.99,75.41 R21.2 19.43,75.53 R20.2 19.66,77.98 22.1,77.98 26.92,73.15 31.37,73.15 32.39,74.17 U1.3 35.18,81.03 C2.2
VIN  (via drill 0.5)  (2 unrouted)
  Top 0.406: 17.41,49.64 P-FET.2 15.82,52.64 C4.1 14.35,52.19 13.46,53.09 13.46,53.13 3.3V_VREG.2 11.41,55.36 | C12.2 16.76,49.28 | 16.76,49.28 17.05,49.28 17.41,49.64 | 17.41,49.64 17.01,49.64 16.51,49.15 16.64,49.15 16.76,49.28
  other vias: 64.77,14.86 52.58,45.34
(copper drawn outside any net)
  shapes: Top circle x6

### Text on the board
Top: fablab | digiscope | r.1 | anti-viral | RESET | GND | ISP | POS | ERROR | SENSORS | TIME | TX | RX | TEMP | fablab | 3.3V | digiscope | anti-viral | REG | rev.1
tPlace: 328P